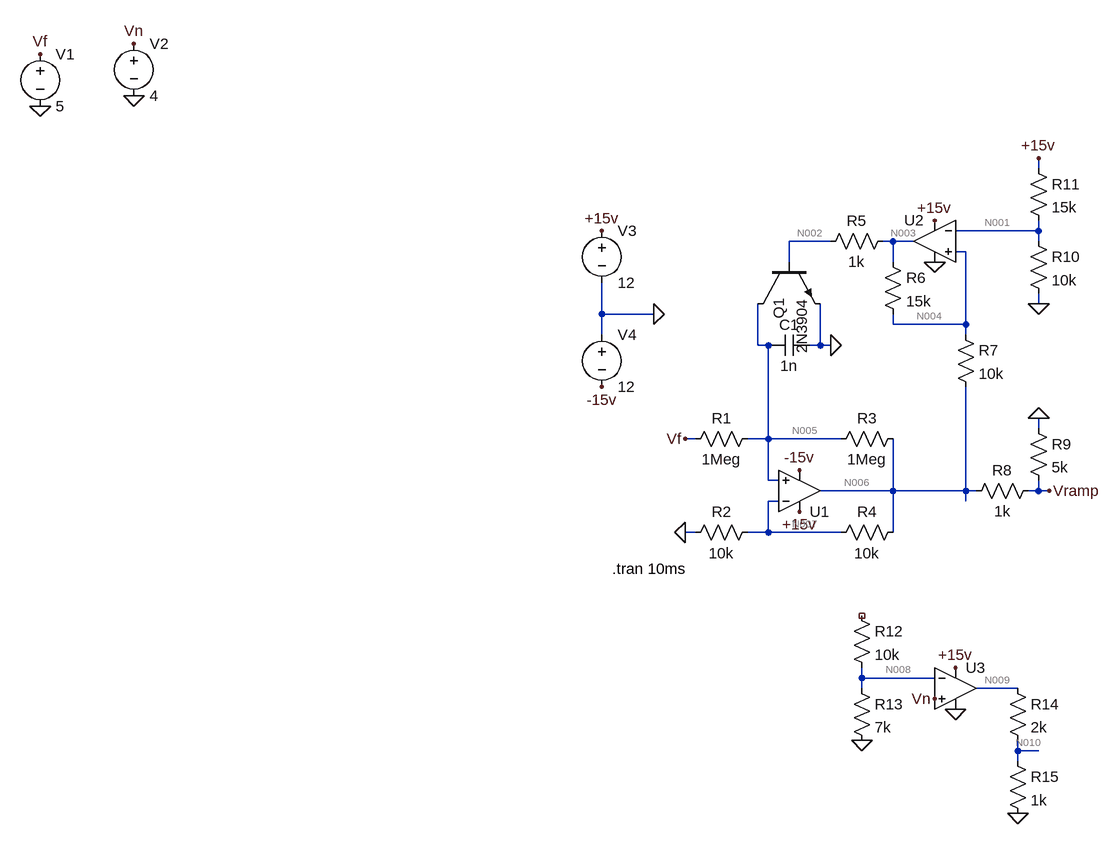
[diagram p0: schematic ramplol.asc]
ramplol.asc, the LTspice schematic file:
Version 4.1
SHEET 1 948 680
WIRE 592 -336 592 -352
WIRE 592 -240 592 -256
WIRE 592 -240 464 -240
WIRE 272 -224 208 -224
WIRE 368 -224 352 -224
WIRE 400 -224 368 -224
WIRE 592 -224 592 -240
WIRE 480 -208 464 -208
WIRE 208 -192 208 -224
WIRE 368 -192 368 -224
WIRE 592 -128 592 -144
WIRE -80 -112 -80 -160
WIRE 0 -112 -80 -112
WIRE 368 -96 368 -112
WIRE 480 -96 480 -208
WIRE 480 -96 368 -96
WIRE -80 -80 -80 -112
WIRE 480 -80 480 -96
WIRE 160 -64 160 -128
WIRE 176 -64 160 -64
WIRE 256 -64 256 -128
WIRE 256 -64 240 -64
WIRE 272 -64 256 -64
WIRE 592 64 592 48
WIRE 64 80 48 80
WIRE 176 80 176 -64
WIRE 176 80 144 80
WIRE 288 80 176 80
WIRE 176 144 176 80
WIRE 192 144 176 144
WIRE 368 160 368 80
WIRE 368 160 256 160
WIRE 480 160 480 0
WIRE 480 160 368 160
WIRE 496 160 480 160
WIRE 592 160 592 144
WIRE 592 160 576 160
WIRE 608 160 592 160
WIRE 192 176 176 176
WIRE 480 176 480 160
WIRE 64 224 48 224
WIRE 176 224 176 176
WIRE 176 224 144 224
WIRE 288 224 176 224
WIRE 368 224 368 160
WIRE 320 448 320 432
WIRE 432 448 320 448
WIRE 320 464 320 448
WIRE 560 464 496 464
WIRE 560 560 560 544
WIRE 592 560 560 560
WIRE 560 576 560 560
FLAG 48 224 0
FLAG 272 -64 0
FLAG 592 48 0
FLAG 592 -128 0
FLAG -944 -512 Vf
FLAG -944 -432 0
FLAG 608 160 Vramp
FLAG 48 80 Vf
FLAG 320 544 0
FLAG 432 480 Vn
FLAG 464 496 0
FLAG 560 656 0
FLAG 0 -112 0
FLAG -80 -240 +15v
FLAG -80 0 -15v
FLAG 224 192 +15v
FLAG 224 128 -15v
FLAG 464 432 +15v
FLAG 432 -256 +15v
FLAG 592 -352 +15v
FLAG -800 -528 Vn
FLAG -800 -448 0
FLAG 432 -192 0
SYMBOL res 160 64 R90
WINDOW 0 0 56 VBottom 2
WINDOW 3 32 56 VTop 2
SYMATTR InstName R1
SYMATTR Value 1Meg
SYMBOL res 160 208 R90
WINDOW 0 0 56 VBottom 2
WINDOW 3 32 56 VTop 2
SYMATTR InstName R2
SYMATTR Value 10k
SYMBOL res 384 64 R90
WINDOW 0 0 56 VBottom 2
WINDOW 3 32 56 VTop 2
SYMATTR InstName R3
SYMATTR Value 1Meg
SYMBOL res 384 208 R90
WINDOW 0 0 56 VBottom 2
WINDOW 3 32 56 VTop 2
SYMATTR InstName R4
SYMATTR Value 10k
SYMBOL cap 240 -80 R90
WINDOW 0 0 32 VBottom 2
WINDOW 3 32 32 VTop 2
SYMATTR InstName C1
SYMATTR Value 1n
SYMBOL npn 160 -192 M90
SYMATTR InstName Q1
SYMATTR Value 2N3904
SYMBOL res 368 -240 R90
WINDOW 0 0 56 VBottom 2
WINDOW 3 32 56 VTop 2
SYMATTR InstName R5
SYMATTR Value 1k
SYMBOL res 352 -208 R0
SYMATTR InstName R6
SYMATTR Value 15k
SYMBOL res 464 -96 R0
SYMATTR InstName R7
SYMATTR Value 10k
SYMBOL res 592 144 R90
WINDOW 0 0 56 VBottom 2
WINDOW 3 32 56 VTop 2
SYMATTR InstName R8
SYMATTR Value 1k
SYMBOL res 576 48 R0
SYMATTR InstName R9
SYMATTR Value 5k
SYMBOL res 576 -240 R0
SYMATTR InstName R10
SYMATTR Value 10k
SYMBOL res 576 -352 R0
SYMATTR InstName R11
SYMATTR Value 15k
SYMBOL voltage -944 -528 R0
SYMATTR InstName V1
SYMATTR Value 5
SYMBOL res 304 336 R0
SYMATTR InstName R12
SYMATTR Value 10k
SYMBOL res 304 448 R0
SYMATTR InstName R13
SYMATTR Value 7k
SYMBOL OpAmps\\UniversalOpAmp2 464 464 R0
SYMATTR InstName U3
SYMBOL res 544 448 R0
SYMATTR InstName R14
SYMATTR Value 2k
SYMBOL res 544 560 R0
SYMATTR InstName R15
SYMATTR Value 1k
SYMBOL voltage -80 -256 R0
SYMATTR InstName V3
SYMATTR Value 12
SYMBOL voltage -80 -96 R0
SYMATTR InstName V4
SYMATTR Value 12
SYMBOL OpAmps\\UniversalOpAmp2 432 -224 M0
SYMATTR InstName U2
SYMBOL voltage -800 -544 R0
SYMATTR InstName V2
SYMATTR Value 4
SYMBOL OpAmps\\UniversalOpAmp2 224 160 M180
SYMATTR InstName U1
TEXT -64 280 Left 2 !.tran 10ms

The netlist it stands for:
* ramplol.asc
R1 N005 Vf 1Meg
R2 N007 0 10k
R3 N006 N005 1Meg
R4 N006 N007 10k
C1 0 N005 1n
Q1 N005 N002 0 0 2N3904
R5 N003 N002 1k
R6 N003 N004 15k
R7 N004 N006 10k
R8 Vramp N006 1k
R9 0 Vramp 5k
R10 N001 0 10k
R11 +15v N001 15k
V1 Vf 0 5
R12 NC_01 N008 10k
R13 N008 0 7k
X§U3 Vn N008 +15v 0 N009 level2 Avol=1Meg GBW=10Meg Slew=10Meg Ilimit=25m Rail=0 Vos=0 En=0 Enk=0 In=0 Ink=0 Rin=500Meg  ; pins In+ In- V+ V- OUT
R14 N009 N010 2k
R15 N010 0 1k
V3 +15v 0 12
V4 0 -15v 12
X§U2 N004 N001 +15v 0 N003 level2 Avol=1Meg GBW=10Meg Slew=10Meg Ilimit=25m Rail=0 Vos=0 En=0 Enk=0 In=0 Ink=0 Rin=500Meg  ; pins In+ In- V+ V- OUT
V2 Vn 0 4
X§U1 N005 N007 +15v -15v N006 level2 Avol=1Meg GBW=10Meg Slew=10Meg Ilimit=25m Rail=0 Vos=0 En=0 Enk=0 In=0 Ink=0 Rin=500Meg  ; pins In+ In- V+ V- OUT
.model NPN NPN
.model PNP PNP
.lib standard.bjt
.tran 10ms
.lib UniversalOpAmp2.lib
.backanno
.end

* Results of the author's LTspice run, read from the files saved beside the schematic
* Operating Point, zero values left out:
*   V(vf) = 5 V
*   V(n006) = 7.655 V
*   V(n002) = 517.2 mV
*   V(n004) = 4.8 V
*   V(+15v) = 12 V
*   V(n008) = 84 µV
*   V(vn) = 4 V
*   V(n010) = 3.986 V
*   V(n005) = 3.828 V
*   V(n007) = 3.828 V
*   V(n003) = 517.2 mV
*   V(vramp) = 6.379 V
*   V(n001) = 4.8 V
*   V(n009) = 11.96 V
*   V(-15v) = -12 V
*   I(R3) = 3.828 µA
*   Ic(Q1) = 4.992 µA
*   Ib(Q1) = 16.11 nA
*   Ie(Q1) = -5.009 µA
*   I(R6) = -285.5 µA
*   I(R9) = -1.276 mA
*   I(R11) = 480 µA
*   I(V1) = -1.172 µA
*   I(R13) = 12 nA
*   I(R14) = 3.986 mA
*   I(R1) = -1.172 µA
*   I(V3) = -6.923 mA
*   I(V4) = -367.8 µA
*   I(R2) = 382.8 µA
*   I(R4) = 382.8 µA
*   I(R5) = 16.11 nA
*   I(R7) = -285.5 µA
*   I(R8) = -1.276 mA
*   I(R10) = 480 µA
*   I(R15) = 3.986 mA
*   I(V2) = 4 nA
*   Ix(u2:1) = -2.4 nA
*   Ix(u2:2) = -2.4 nA
*   Ix(u2:3) = 139.7 µA
*   Ix(u2:4) = -425.2 µA
*   Ix(u2:5) = 285.5 µA
*   Ix(u3:1) = -4 nA
*   Ix(u3:2) = -12 nA
*   Ix(u3:3) = 3.987 mA
*   Ix(u3:4) = -1.365 µA
*   Ix(u3:5) = -3.986 mA
*   Ix(u1:1) = 7.655 nA
*   Ix(u1:2) = 7.655 nA
*   Ix(u1:3) = 2.316 mA
*   Ix(u1:4) = -367.8 µA
*   Ix(u1:5) = -1.948 mA
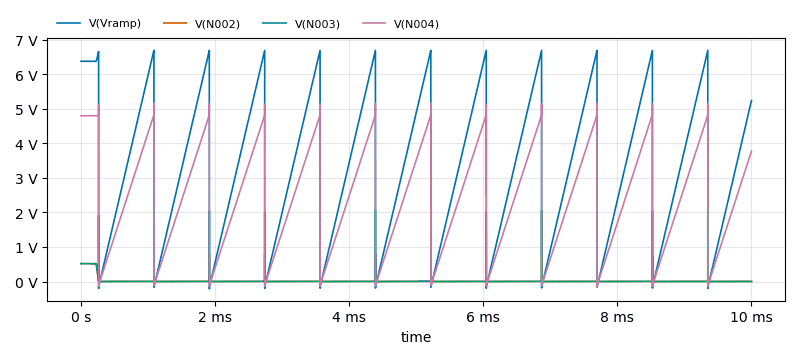
[diagram p1: Transient Analysis of ramplol.asc, plotted from the saved traces]
* Transient Analysis, 1 run:
*   V(Vramp): min -210.7 mV, max 6.694 V, average 3.302 V, rms 3.868 V, last 5.242 V
*   V(N002): min -154.5 mV, max 798.6 mV, average 14.85 mV, rms 82.24 mV, last 2.635 mV
*   V(N003): min -1.418 mV, max 2.071 V, average 14.93 mV, rms 85.63 mV, last 2.614 mV
*   V(N004): min -151.6 mV, max 5.162 V, average 2.384 V, rms 2.795 V, last 3.776 V